# EAGLE design ESP8266 adapter (EAGLE 6.6.0)
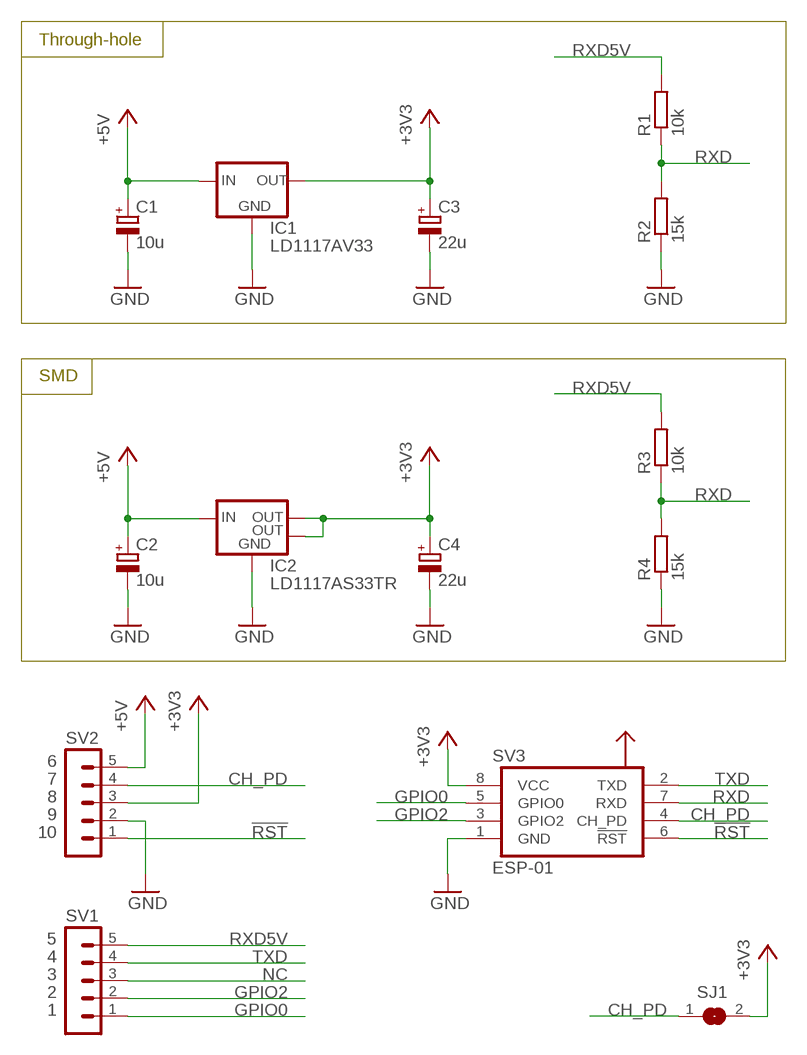
[diagram p0: schematic, sheet 1]

## Parts
C1  10u  CPOL-EUE2.5-5  [E2,5-5]
C2  10u  CPOL-EUA/3216-18W  [A/3216-18W]
C3  22u  CPOL-EUE2.5-5  [E2,5-5]
C4  22u  CPOL-EUB/3528-21R  [B/3528-21R]
IC1  LD1117AV33  V_REG_LD1117VXX  [78XXL]
IC2  LD1117AS33TR  V_REG_LM1117SOT223  [SOT223]
R1  10k  R-EU_0207/10  [0207/10]
R2  15k  R-EU_0207/10  [0207/10]
R3  10k  R-EU_R1206  [R1206]
R4  15k  R-EU_R1206  [R1206]
SJ1  SJ  [SJ]
SV1  MA05-1  [MA05-1]
SV2  MA05-1  [MA05-1]
SV3  ESP-01  [FE04-2]

## Nets
!RST: SV2.1 SV3.6(!RST)
+3V3: C3.+ C4.+ IC1.GND(OUT) IC2.2(OUT) IC2.4(OUT) SJ1.2 SV2.3 SV3.8(VCC)
+5V: C1.+ C2.+ IC1.OUT(IN) IC2.3(IN) SV2.5
CH_PD: SJ1.1 SV2.4 SV3.4(CH_PD)
GND: C1.- C2.- C3.- C4.- IC1.IN(GND) IC2.1(GND) R2.1 R4.1 SV2.2 SV3.1(GND)
GPIO0: SV1.1 SV3.5(GPIO0)
GPIO2: SV1.2 SV3.3(GPIO2)
NC: SV1.3
RXD: R1.1 R2.2 R3.1 R4.2 SV3.7(RXD)
RXD5V: R1.2 R3.2 SV1.5
TXD: SV1.4 SV3.2(TXD)

## Notes on the sheet
- Through-hole
- SMD
- 6
- 7
- 8
- 9
- 10
- 5
- 4
- 3
- 2
- 1

## Library data of the parts
C1-C4 = rcl:CPOL-EU: POLARIZED CAPACITOR, European symbol
IC1 = SparkFun-PowerIC:V_REG_LD1117VXX: LD1117VXX voltage regulator. We carry the 3.3V version (COM-00526) in TO-220 package.
IC2 = SparkFun-PowerIC:V_REG_LM1117: Voltage Regulator LM1117 Standard adjustable voltage regulator but in SMD form. Spark Fun Electronics SKU : COM-00595; PROD_ID: VREG-08170
R1-R4 = rcl:R-EU_: RESISTOR, European symbol
SJ1 = jumper:SJ: SMD solder JUMPER
SV1 SV2 = ESP8266:MA05-1: PIN HEADER; OC_FARNELL: unknown; OC_NEWARK: unknown
SV3 = ESP8266:ESP-01: ESP-01 - Female Header

## Board
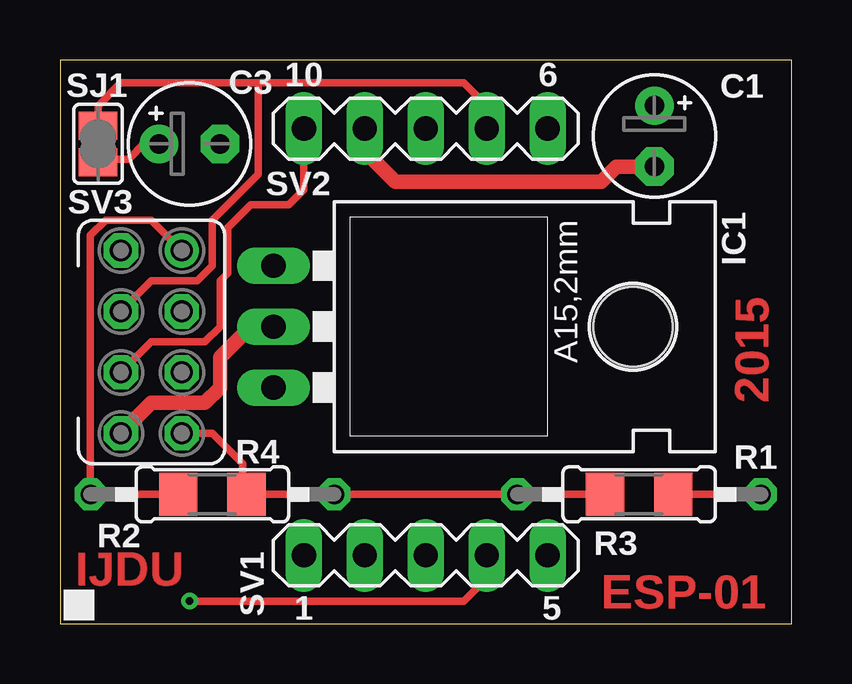
[diagram p1: board, top side]
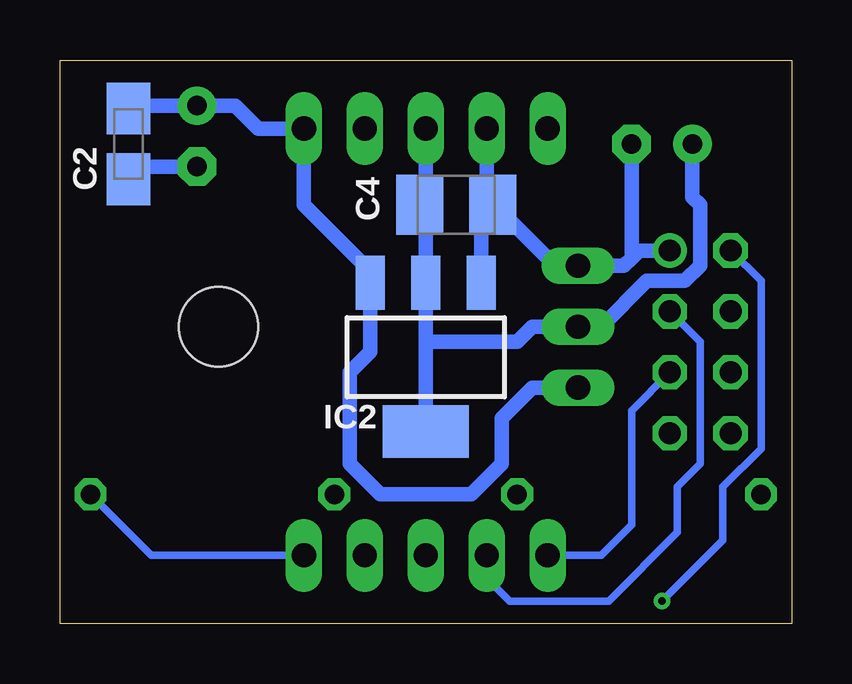
[diagram p2: board, bottom side, seen from below]

Size 30.48 x 23.5 mm. Coordinates in mm from the lower left corner, seen from the top.
Outline: 0,0 30.48,0 30.48,23.5 0,23.5 0,0
Copper layers (1*16): Top 0.035mm / dielectric 1.5mm / Bottom 0.035mm
Design rules "default *": minimum track width 0.15mm, minimum drill 0.3mm, track to track 8mil, track to pad 8mil, pad to pad 8mil, via to via 8mil, smd to smd 8mil, copper to edge 0.5mm, drill to drill 0.3mm, minimum pad ring 10mil, minimum via ring 8mil, stop-mask expansion 4mil, vias tented up to drill 0.3mm, thermal gap 10mil

### Footprints (pad centres in the part's own frame; a part is rotated, then mirrored left to right if it is on the bottom)
E2,5-5 = drill 0.813 pad 1.6: + -1.27,0 | drill 0.813 pad 1.6 octagon: - 1.27,0
A/3216-18W = smd 2.15 x 1.8: + 1.475,0; - -1.475,0
B/3528-21R = smd 1.95 x 2.5: + 1.525,0; - -1.525,0
78XXL = drill 1.016 long: GND 0,-3.81; IN -2.54,-3.81; OUT 2.54,-3.81 | hole 3.302: 0,11.176
SOT223 = smd 1.219 x 2.235: 1 -2.311,-3.099; 2 0,-3.099; 3 2.311,-3.099 | smd 3.6 x 2.2: 4 0,3.099
0207/10 = drill 0.813 octagon: 1 -5.08,0; 2 5.08,0
R1206 = smd 1.6 x 1.803: 1 -1.422,0; 2 1.422,0
SJ = smd 1.168 x 1.6: 1 -0.762,0; 2 0.762,0
MA05-1 = drill 1.016 long: 1 -5.08,0; 2 -2.54,0; 3 0,0; 4 2.54,0; 5 5.08,0
FE04-2 = drill 0.914: 1 -5.08,1.27 | drill 0.914 octagon: 2 -5.08,-1.27; 3 -2.54,1.27; 4 -2.54,-1.27; 5 0,1.27; 6 0,-1.27; 7 2.54,1.27; 8 2.54,-1.27

### Placement (x,y rotation side)
C1  24.77,20.32 270 top
C2  27.62,20 90 bottom
C3  5.4,20 0 top
C4  13.97,17.46 180 bottom
IC1  12.7,12.38 270 top
IC2  15.24,11.11 180 bottom
R1  24.13,5.4 0 top
R2  6.35,5.4 0 top
R3  24.13,5.4 0 top
R4  6.35,5.4 0 top
SJ1  1.59,20 270 top
SV1  15.24,2.86 0 top
SV2  15.24,20.64 0 top
SV3  3.81,10.48 270 top

### Tracks (layer width: path | path; a pad name or v marks a point on that pad's centre or on a via)
!RST
  Top 0.305: SV3.6 3.81,11.75 6.03,11.75 6.67,12.38 6.67,14.29 6.99,14.61 6.99,16.51 7.94,17.46 9.53,17.46 10.16,18.1 SV2.1
+3V3
  Top 0.305: C3.+ 3.49,20 2.86,19.37 1.71,19.37 SJ1.2
  Top 0.61: SV3.8 3.81,9.21 6.03,9.21 6.67,9.84 6.67,11.11 7.94,12.38 IC1.GND
  Bottom 0.61: IC2.4 15.24,11.75 | 15.24,11.75 IC2.2 15.24,17.21 C4.+ 15.24,17.72 SV2.3 | 15.24,11.75 11.43,11.75 10.79,12.38 IC1.GND 7.94,12.38 6.03,14.29 4.45,14.29 3.81,14.92 3.81,17.46 4.13,17.78 C3.+
+5V
  Bottom 0.61: IC1.OUT 10.79,9.84 12.06,8.57 12.06,6.67 13.34,5.4 17.14,5.4 18.41,6.67 18.41,10.48 17.55,11.34 IC2.3 17.55,14.9 17.76,14.9 20.32,17.46 SV2.5 22.23,20.64 23.18,21.59 C1.+ 27.62,21.59 C2.+
CH_PD
  Top 0.305: 8.26,22.54 2.54,22.54 1.59,21.59 SJ1.1 | 8.26,22.54 16.83,22.54 17.78,21.59 SV2.4 | SV3.4 3.81,14.29 5.71,14.29 6.35,14.92 6.35,16.83 8.26,18.73 8.26,22.54
GND
  Top 0.305: R4.1 R2.1 1.27,16.19 1.91,16.83 3.81,16.83 SV3.1
  Top 0.61: SV2.2 12.7,19.68 13.97,18.41 22.54,18.41 23.18,19.05 C1.-
  Bottom 0.61: IC2.1 12.93,16.83 | 12.93,16.83 12.93,17.31 C4.- 12.7,17.72 SV2.2 | 12.93,16.83 11.75,16.83 9.84,14.92 IC1.IN 6.99,14.92 6.67,15.24 | SV3.1 6.35,15.56 6.67,15.24 | C2.- 27.62,19.05 C1.- | C3.- 6.67,15.24
GPIO0
  Bottom 0.305: SV3.5 6.67,8.89 6.67,4.13 7.94,2.86 SV1.1
GPIO2
  Bottom 0.305: SV3.3 3.81,11.75 3.81,6.67 4.76,5.71 4.76,3.81 7.62,0.95 11.75,0.95 12.7,1.91 SV1.2
N$1
  Top 0.254: 1.59,20.64 1.59,19.37
RXD
  Top 0.305: R3.1 R1.1 R2.2 R4.2 7.62,5.55 7.62,6.67 6.35,7.94 SV3.7
RXD5V
  Top 0.305: R3.2 R1.2
  Bottom 0.305: SV1.5 26.67,2.86 R1.2
TXD  (via drill 0.3)
  Top 0.305: v5.4,0.95 16.83,0.95 17.78,1.91 SV1.4
  Bottom 0.305: SV3.2 1.27,14.29 1.27,7.3 2.86,5.71 2.86,3.49 v5.4,0.95

### Text on the board
Top: 2015 | IJDU | ESP-01
tPlace: 10 | 6 | 1 | 5
tValues: LD1117
bValues: LD1117